# EAGLE schematic IOBoard (EAGLE 6.2)
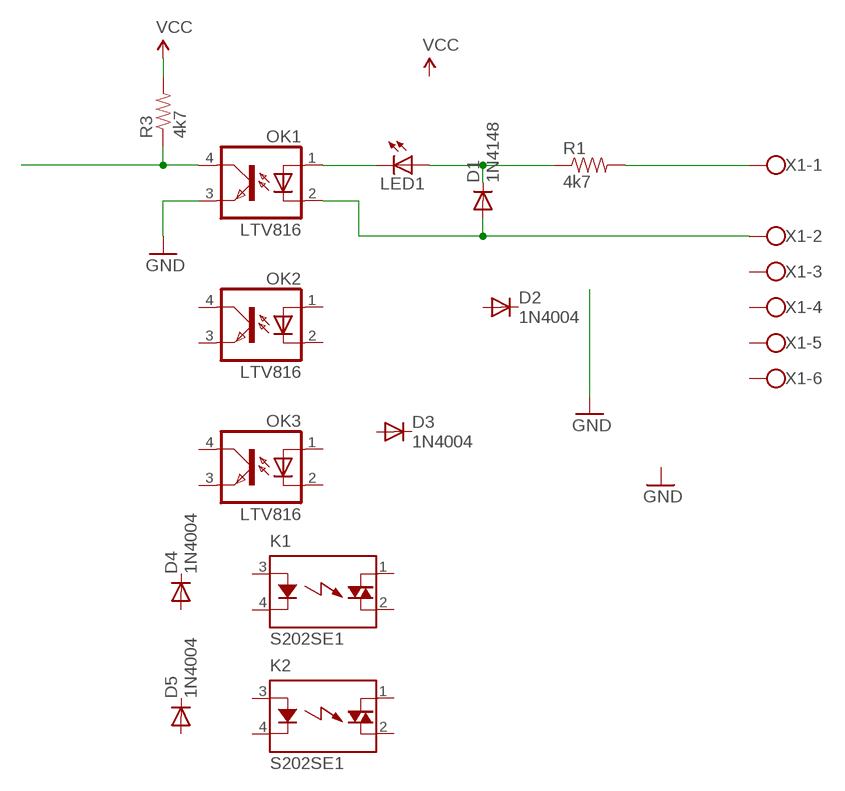
[diagram p0: schematic, sheet 1]

## Parts
D1  1N4148  [DO34-5]
D2  1N4004  [DO41-10]
D3  1N4004  [DO41-10]
D4  1N4004  [DO41-10]
D5  1N4004  [DO41-10]
K1  S202SE1  [S2XXEX]
K2  S202SE1  [S2XXEX]
LED1  LED3MM  [LED3MM]
OK1  LTV816  [DIL04]
OK2  LTV816  [DIL04]
OK3  LTV816  [DIL04]
R1  4k7  RESISTORPTH-1/6W  [1/6W-RES]
R3  4k7  RESISTORPTH-1/6W  [1/6W-RES]
X1  W237-6  [W237-6]

## Nets
GND: OK1.3(EMIT)
N$1: LED1.K(C) OK1.1(A)
N$2: R1.2 X1.1
N$3: D1.A OK1.2(C) X1.2
N$4: D1.C LED1.A R1.1
N$5: OK1.4(COL) R3.1
VCC: R3.2
Unconnected: D2.A D2.C D3.A D3.C D4.A D4.C D5.A D5.C K1.1(DS1) K1.2(DS2) K1.3(A) K1.4(K) K2.1(DS1) K2.2(DS2) K2.3(A) K2.4(K) OK2.1(A) OK2.2(C) OK2.3(EMIT) OK2.4(COL) OK3.1(A) OK3.2(C) OK3.3(EMIT) OK3.4(COL) X1.3 X1.4 X1.5 X1.6

## Library data of the parts
D1 = My Library:1N4148
D2-D5 = diode:1N4004: DIODE general purpose rectifier, 1 A
K1 K2 = relay:S2*: SIP Type SSR for Medium Power Control SHARP Source: 168149-da-01-en-Solid_State_Relais_S_202_SE1_SE2.pdf; OC_FARNELL: unknown; OC_NEWARK: unknown
LED1 = adafruit:LED: LED OSRAM: - CHIPLED LG R971, LG N971, LY N971, LG Q971, LY Q971, LO R971, LY R971 LH N974, LH R974 LS Q976, LO Q976, LY Q976 LO Q996 - Hyper CHIPLED LW Q18S LB Q993, LB Q99A, LB R99A - SideLED LS A670, LO A670, LY A670, LG A670, LP A670 LB A673, LV A673, LT A673, LW A673 LH A674 LY A675 LS A676, LA A676, LO A676, LY A676, LW A676 LS A679, LY A679, LG A679 - Hyper Micro SIDELED® LS Y876, LA Y876, LO Y876, LY Y876 LT Y87S - SmartLED LW L88C, LW L88S LB L89C, LB L89S, LG L890 LS L89K, LO L89K, LY L89K LS L896, LA L896, LO L896, LY L896 - TOPLED LS T670, LO T670, LY T670, LG T670, LP T670 LSG T670, LSP T670, LSY T670, LOP T670, LYG T670 LG T671, LOG T671, LSG T671 LB T673, LV T673, LT T673, LW T673 LH T674 LS T676, LA T676, LO T676, LY T676, LB T676, LH T676, LSB T676, LW T676 LB T67C, LV T67C, LT T67C, LS T67K, LO T67K, LY T67K, LW E67C LS E67B, LA E67B, LO E67B, LY E67B, LB E67C, LV E67C, LT E67C LW T67C LS T679, LY T679, LG T679 LS T770, LO T770, LY T770, LG T770, LP T770 LB T773, LV T773, LT T773, LW T773 LH T774 LS E675, LA E675, LY E675, LS T675 LS T776, LA T776, LO T776, LY T776, LB T776 LHGB T686 LT T68C, LB T68C - Hyper Mini TOPLED® LB M676 - Mini TOPLED Santana® LG M470 LS M47K, LO M47K, LY M47K Source: http://www.osram.convergy.de/
OK1-OK3 = optocoupler:LTV816: OPTO COUPLER Source: LITEON, LTV816.pdf; OC_FARNELL: unknown; OC_NEWARK: unknown
R1 R3 = My Library:RESISTOR: Resistor Basic schematic elements and footprints for 0603, 1206, and PTH resistors.
X1 = con-wago-500:W237-6: WAGO SCREW CLAMP; OC_FARNELL: unknown; OC_NEWARK: unknown